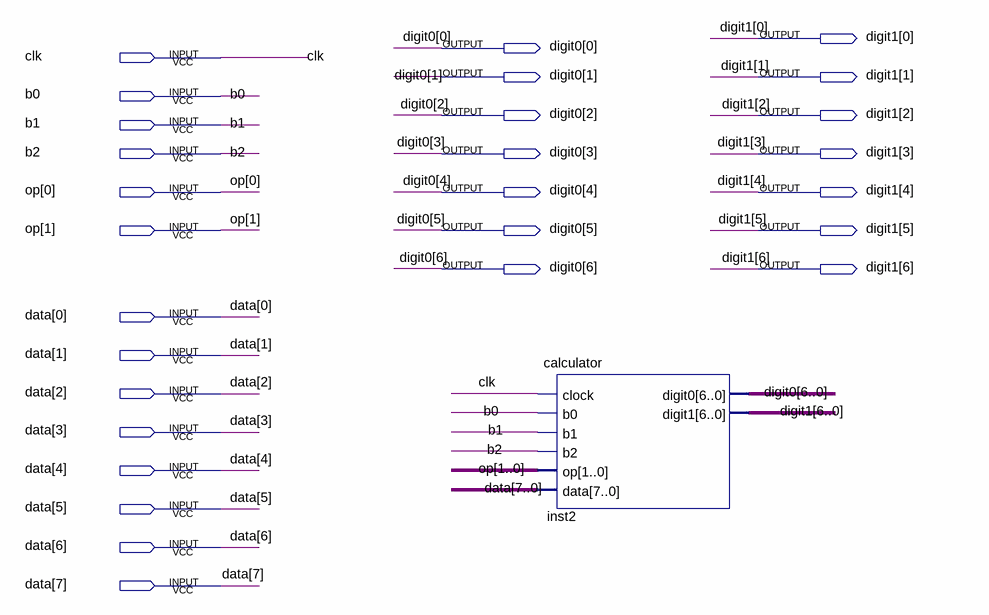
[diagram p0: schematic sheet]
// Quartus schematic calculatorDiag.bdf as structural Verilog: 1 symbols, 28 pins
module calculatorDiag (
  input  clk,
  input  b0,
  input  b1,
  input  b2,
  input  [1:0] op,
  input  [7:0] data,
  output [6:0] digit1,
  output [6:0] digit0
);

  calculator inst2 (.clock(clk), .b0(b0), .b1(b1), .b2(b2), .op(op), .data(data), .digit0(digit0), .digit1(digit1));
endmodule
